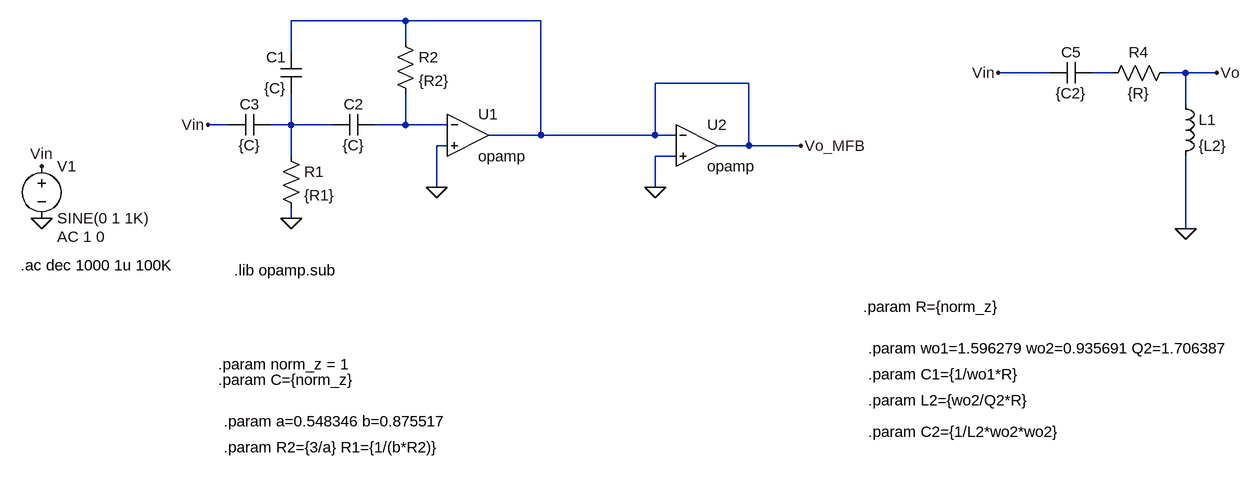
[diagram p0: schematic MFB_vs_etapa2_normalizado.asc]
MFB_vs_etapa2_normalizado.asc, the LTspice schematic file:
Version 4.1
SHEET 1 2160 696
WIRE 432 -64 256 -64
WIRE 640 -64 432 -64
WIRE 432 -32 432 -64
WIRE 256 -16 256 -64
WIRE 1424 16 1344 16
WIRE 1520 16 1488 16
WIRE 1632 16 1600 16
WIRE 1680 16 1632 16
WIRE 960 32 816 32
WIRE 1632 64 1632 16
WIRE 160 96 128 96
WIRE 256 96 256 48
WIRE 256 96 224 96
WIRE 320 96 256 96
WIRE 432 96 432 48
WIRE 432 96 384 96
WIRE 496 96 432 96
WIRE 640 112 640 -64
WIRE 640 112 560 112
WIRE 816 112 816 32
WIRE 816 112 640 112
WIRE 848 112 816 112
WIRE 496 128 480 128
WIRE 960 128 960 32
WIRE 960 128 912 128
WIRE 1040 128 960 128
WIRE 256 144 256 96
WIRE 848 144 816 144
WIRE 480 192 480 128
WIRE 816 192 816 144
WIRE 256 240 256 224
WIRE 1632 256 1632 144
FLAG -128 240 0
FLAG -128 160 Vin
FLAG 480 192 0
FLAG 256 240 0
FLAG 128 96 Vin
FLAG 1040 128 Vo_MFB
FLAG 1344 16 Vin
FLAG 1680 16 Vo
FLAG 1632 256 0
FLAG 816 192 0
SYMBOL OpAmps\\opamp 528 48 R0
SYMATTR InstName U1
SYMBOL voltage -128 144 R0
WINDOW 123 24 124 Left 2
WINDOW 39 0 0 Left 0
SYMATTR Value2 AC 1 0
SYMATTR InstName V1
SYMATTR Value SINE(0 1 1K)
SYMBOL res 240 128 R0
SYMATTR InstName R1
SYMATTR Value {R1}
SYMBOL cap 272 48 R180
WINDOW 0 24 56 Left 2
WINDOW 3 24 8 Left 2
SYMATTR InstName C1
SYMATTR Value {C}
SYMBOL cap 320 112 R270
WINDOW 0 32 32 VTop 2
WINDOW 3 0 32 VBottom 2
SYMATTR InstName C2
SYMATTR Value {C}
SYMBOL cap 160 112 R270
WINDOW 0 32 32 VTop 2
WINDOW 3 0 32 VBottom 2
SYMATTR InstName C3
SYMATTR Value {C}
SYMBOL res 416 -48 R0
SYMATTR InstName R2
SYMATTR Value {R2}
SYMBOL cap 1488 0 R90
WINDOW 0 0 32 VBottom 2
WINDOW 3 32 32 VTop 2
SYMATTR InstName C5
SYMATTR Value {C2}
SYMBOL res 1616 0 R90
WINDOW 0 0 56 VBottom 2
WINDOW 3 32 56 VTop 2
SYMATTR InstName R4
SYMATTR Value {R}
SYMBOL ind 1616 48 R0
SYMATTR InstName L1
SYMATTR Value {L2}
SYMATTR SpiceLine Rser=1m
SYMBOL OpAmps\\opamp 880 64 R0
SYMATTR InstName U2
TEXT -160 312 Left 2 !.ac dec 1000 1u 100K
TEXT 168 320 Left 2 !.lib opamp.sub
TEXT 144 464 Left 2 !.param norm_z = 1
TEXT 144 488 Left 2 !.param C={norm_z}
TEXT 152 552 Left 2 !.param a=0.548346 b=0.875517
TEXT 152 592 Left 2 !.param R2={3/a} R1={1/(b*R2)}
TEXT 1136 376 Left 2 !.param R={norm_z}
TEXT 1144 440 Left 2 !.param wo1=1.596279 wo2=0.935691 Q2=1.706387
TEXT 1144 480 Left 2 !.param C1={1/wo1*R}
TEXT 1144 520 Left 2 !.param L2={wo2/Q2*R}
TEXT 1144 568 Left 2 !.param C2={1/L2*wo2*wo2}

The netlist it stands for:
* MFB_vs_etapa2_normalizado.asc
X§U1 N003 0 Vo_MFB opamp Aol=100K GBW=10Meg  ; pins invin noninvin out
V1 Vin 0 SINE(0 1 1K) AC 1 0
R1 N002 0 {R1}
C1 N002 Vo_MFB {C}
C2 N002 N003 {C}
C3 Vin N002 {C}
R2 Vo_MFB N003 {R2}
C5 N001 Vin {C2}
R4 Vo N001 {R}
L1 Vo 0 {L2} Rser=1m
X§U2 Vo_MFB 0 Vo_MFB opamp Aol=100K GBW=10Meg  ; pins invin noninvin out
.ac dec 1000 1u 100K
.lib opamp.sub
.param norm_z = 1
.param C={norm_z}
.param a=0.548346 b=0.875517
.param R2={3/a} R1={1/(b*R2)}
.param R={norm_z}
.param wo1=1.596279 wo2=0.935691 Q2=1.706387
.param C1={1/wo1*R}
.param L2={wo2/Q2*R}
.param C2={1/L2*wo2*wo2}
.backanno
.end